# Altium project Power_circuit.PrjPcb
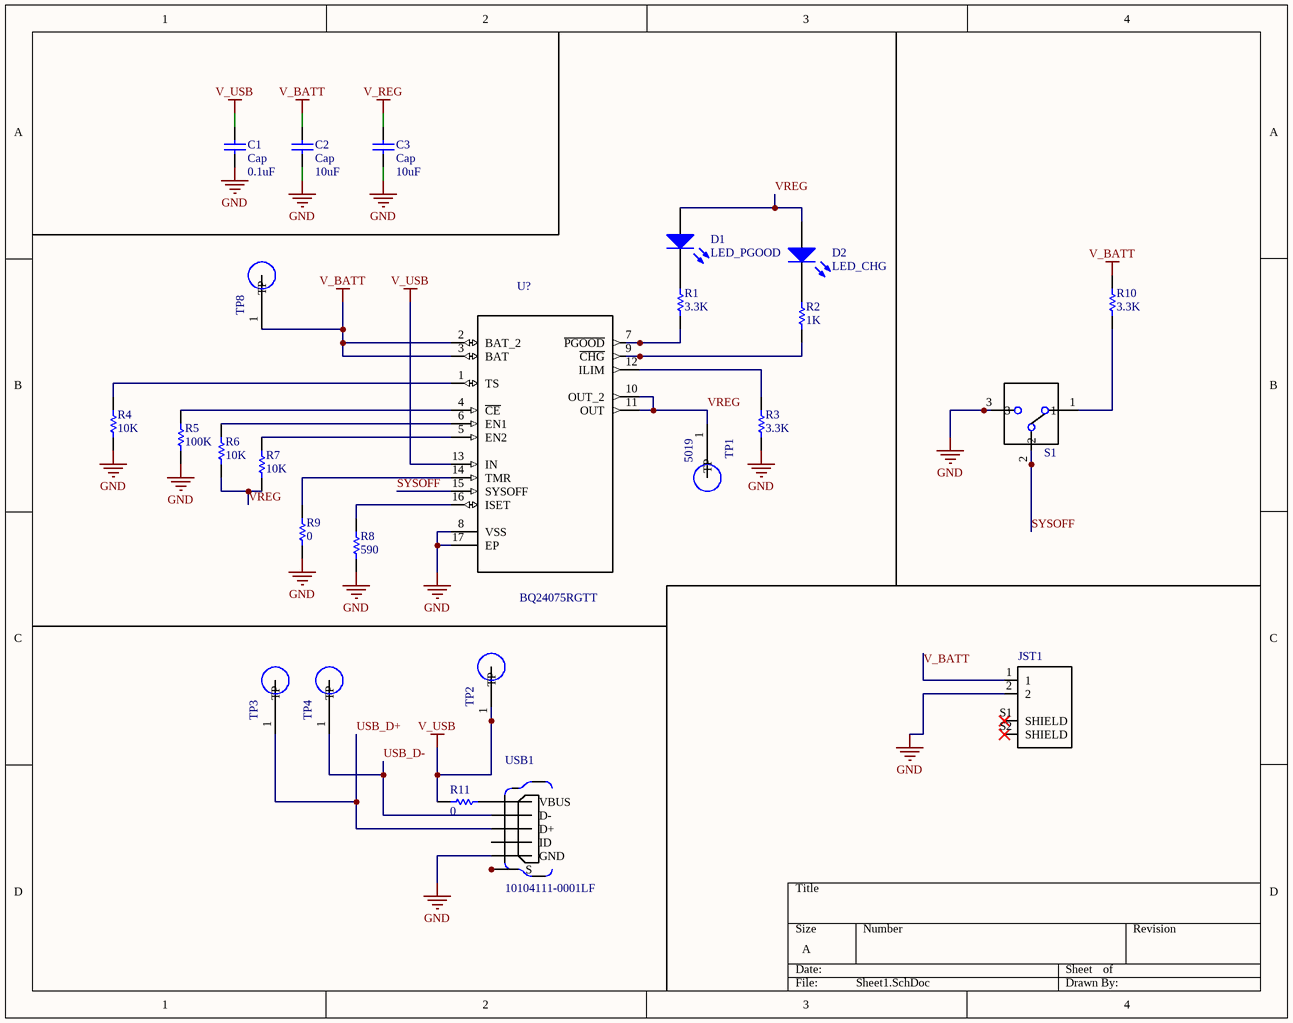
[diagram p0: Sheet1.SchDoc]
2 sheets, 35 parts. Net scope: global (net labels, ports and power ports of the same name join across sheets).
Sheets:
  Sheet1.SchDoc
  Sheet2.SchDoc

## Sheet Sheet1.SchDoc
size A

### Parts
C1  Cap  value 0.1uF  [1608[0603]]
C2  Cap  value 10uF  [1608[0603]]
C3  Cap  value 10uF  [1608[0603]]
D1  LED_PGOOD  [1608[0603]]
D2  LED_CHG  [1608[0603]]
JST1  S2B-PH-SM4-TB(LF)(SN)  [*JST_S2B-PH-SM4-TB(LF)(SN)_S2B-PH-SM4-TB(LF)(SN)(Primary)]  (value not drawn)
R1  value 3.3K  [1608[0603]]  (hidden comment: Res1)
R2  value 1K  [1608[0603]]  (hidden comment: Res1)
R3  value 3.3K  [1608[0603]]  (hidden comment: Res1)
R4  value 10K  [1608[0603]]  (hidden comment: Res1)
R5  value 100K  [1608[0603]]  (hidden comment: Res1)
R6  value 10K  [1608[0603]]  (hidden comment: Res1)
R7  value 10K  [1608[0603]]  (hidden comment: Res1)
R8  value 590  [1608[0603]]  (hidden comment: Res1)
R9  value 0  [1608[0603]]  (hidden comment: Res1)
R10  value 3.3K  [1608[0603]]  (hidden comment: Res1)
R11  value 0  [1608[0603]]  (hidden comment: Res1)
S1  CL-SB-12B-01T  [*CL-SB-12B]  (value not drawn)
TP1  5019  [*TP380X203]
TP2  5019  [*TP380X203]  (value not drawn)
TP3  5019  [*TP380X203]  (value not drawn)
TP4  5019  [*TP380X203]  (value not drawn)
TP8  5019  [*TP380X203]  (value not drawn)
U?  BQ24075RGTT  [*QFN50P300X300X100-17N]
USB1  10104111-0001LF  [*FRAMATOME_10104111-0001LF]

### Nets
GND: C1.1 C2.1 C3.1 JST1.2 R3.1 R4.1 R5.1 R8.1 R9.1 S1.3 U?.8(VSS) U?.17(EP) USB1.5(GND)
V_BATT: C2.2 JST1.1 R10.2 TP8.1(TP) U?.2(BAT_2) U?.3(BAT)
V_REG: C3.2
V_USB: C1.2 R11.2 TP2.1(TP) U?.13(IN)
VREG: D1.1(A) D2.1(A) R6.1 R7.1 TP1.1(TP) U?.10(OUT_2) U?.11(OUT)
SYSOFF: S1.2 U?.15(SYSOFF)
USB_D+: TP3.1(TP) USB1.3(D+)
USB_D-: TP4.1(TP) USB1.2(D-)
NetD1_2: D1.2(K) R1.2
NetD2_2: D2.2(K) R2.2
NetR1_1: R1.1 U?.7(~{PGOOD})
NetR2_1: R2.1 U?.9(~{CHG})
NetR3_2: R3.2 U?.12(ILIM)
NetR4_2: R4.2 U?.1(TS)
NetR5_2: R5.2 U?.4(~{CE})
NetR6_2: R6.2 U?.6(EN1)
NetR7_2: R7.2 U?.5(EN2)
NetR8_2: R8.2 U?.16(ISET)
NetR9_2: R9.2 U?.14(TMR)
NetR10_1: R10.1 S1.1
NetR11_1: R11.1 USB1.1(VBUS)
NetUSB1_6: USB1.6(S) USB1.7(S) USB1.8(S) USB1.9(S)

Not connected (* = marked no-connect by the designer): JST1 S1(SHIELD)* S2(SHIELD)*; USB1 4(ID)

### Library data of the parts
C1-C3 = Cap: 10000pF ±10% 50V Ceramic Capacitor X7R 0603 (1608 Metric); Manufacturer: Samsung Electro-Mechanics; Manufacturer Part Number: CL10B103KB8NNNC; Digi-Key Part Number: 1276-1009-1-ND; digi key link url: https://www.digikey.com/product-detail/en/samsung-electro-mechanics/CL10B103KB8NNNC/1276-1009-1-ND/3889095
D1 = LED2: LED GREEN DIFFUSED 0603 SMD; Manufacturer: OSRAM Opto Semiconductors Inc.; Manufacturer Part Number: LG L29K-F2J1-24-Z; Digi-Key Part Number: 475-3118-1-ND; ComponentLink1URL: https://www.digikey.com/product-detail/en/osram-opto-semiconductors-inc/LG-L29K-F2J1-24-Z/475-3118-1-ND/4899549; ComponentLink1Description: Digi-Key Link
D2 = LED2: Blue 470nm LED Indication - Discrete 2.85V 0603 (1608 Metric); Manufacturer: OSRAM Opto Semiconductors Inc.; Manufacturer Part Number: LB Q39G-L2OO-35-1; Digi-Key Part Number: 475-2816-1-ND; ComponentLink1URL: https://www.digikey.com/product-detail/en/osram-opto-semiconductors-inc/LB-Q39G-L2OO-35-1/475-2816-1-ND/2176355; ComponentLink1Description: Digi-Key Link
JST1 = S2B-PH-SM4-TB(LF)(SN): PH Series 2 Position 2 mm Pitch Surface Mount Side Entry Shrouded Header; MF: JST Sales; MP: S2B-PH-SM4-TB_LF__SN_; SnapEDA_Link: https://www.snapeda.com/parts/S2B-PH-SM4-TB%28LF%29%28SN%29/JST%20Sales%20America%20Inc./view-part/?ref=snap; Availability: Unavailable; Price: None; Package: None; Value: *
R1-R11 = Res1: 10 kOhms ±1% 0.125W, 1/8W Chip Resistor 0603 (1608 Metric) Anti-Sulfur, Moisture Resistant Thin Film; Manufacturer: Stackpole Electronics Inc; Manufacturer Part Number: RNCP0603FTD10K0; Digi-Key Part Number: RNCP0603FTD10K0CT-ND; digi key link url: https://www.digikey.com/product-detail/en/stackpole-electronics-inc/RNCP0603FTD10K0/RNCP0603FTD10K0CT-ND/2240478
S1 = CL-SB-12B-01T: SWITCH SLIDE SPDT 200MA 12V; MF: Nidec Copal; SnapEDA_Link: https://www.snapeda.com/parts/CL-SB-12B-01T/Nidec%20Copal%20Electronics/view-part/?ref=snap; Component_link_url: https://www.digikey.com/product-detail/en/nidec-copal-electronics/CL-SB-12B-01T/563-1318-1-ND/3507878; MP: CL-SB-12B-01T; Digi-Key Part Number: 563-1318-1-ND
TP1-TP4 TP8 = 5019: Phosphor Bronze Contact Miniature Silver Plated Surface Mount Test Points; MF: Keystone Electronics; Package: 2010 Keystone; Price: None; Availability: Unavailable; MP: 5019; SnapEDA_Link: https://www.snapeda.com/parts/5019/Keystone%20Electronics/view-part/?ref=snap; Value: *
U? = BQ24075RGTT: USB-Friendly Li-Ion Battery Charger and Power-Path Management IC, Vout 5.5V 16-QFN -40 to 85; Manufacturer Part Number: BQ24075RGTR; MF: Texas Instruments; SnapEDA_Link: https://www.snapeda.com/parts/BQ24075RGTT/Texas%20Instruments/view-part/?ref=snap; Price: None; MP: BQ24075RGTT; Package: QFN-16 Texas Instruments; Value: *; Digi-Key Part Number: 296-38874-1-ND
USB1 = 10104111-0001LF: Micro Usb, 2.0 Type Ab, Receptacle, Th; MF: Amphenol ICC; Package: None; Price: None; Component_link_url: https://www.digikey.com/product-detail/en/amphenol-fci/10104111-0001LF/609-4053-1-ND/2350359?utm_source=snapeda&utm_medium=aggregator&utm_campaign=symbol; MP: 10104111-0001LF; SnapEDA_Link: https://www.snapeda.com/parts/10104111-0001LF/Amphenol%20ICC/view-part/?ref=snap

## Sheet Sheet2.SchDoc
size A
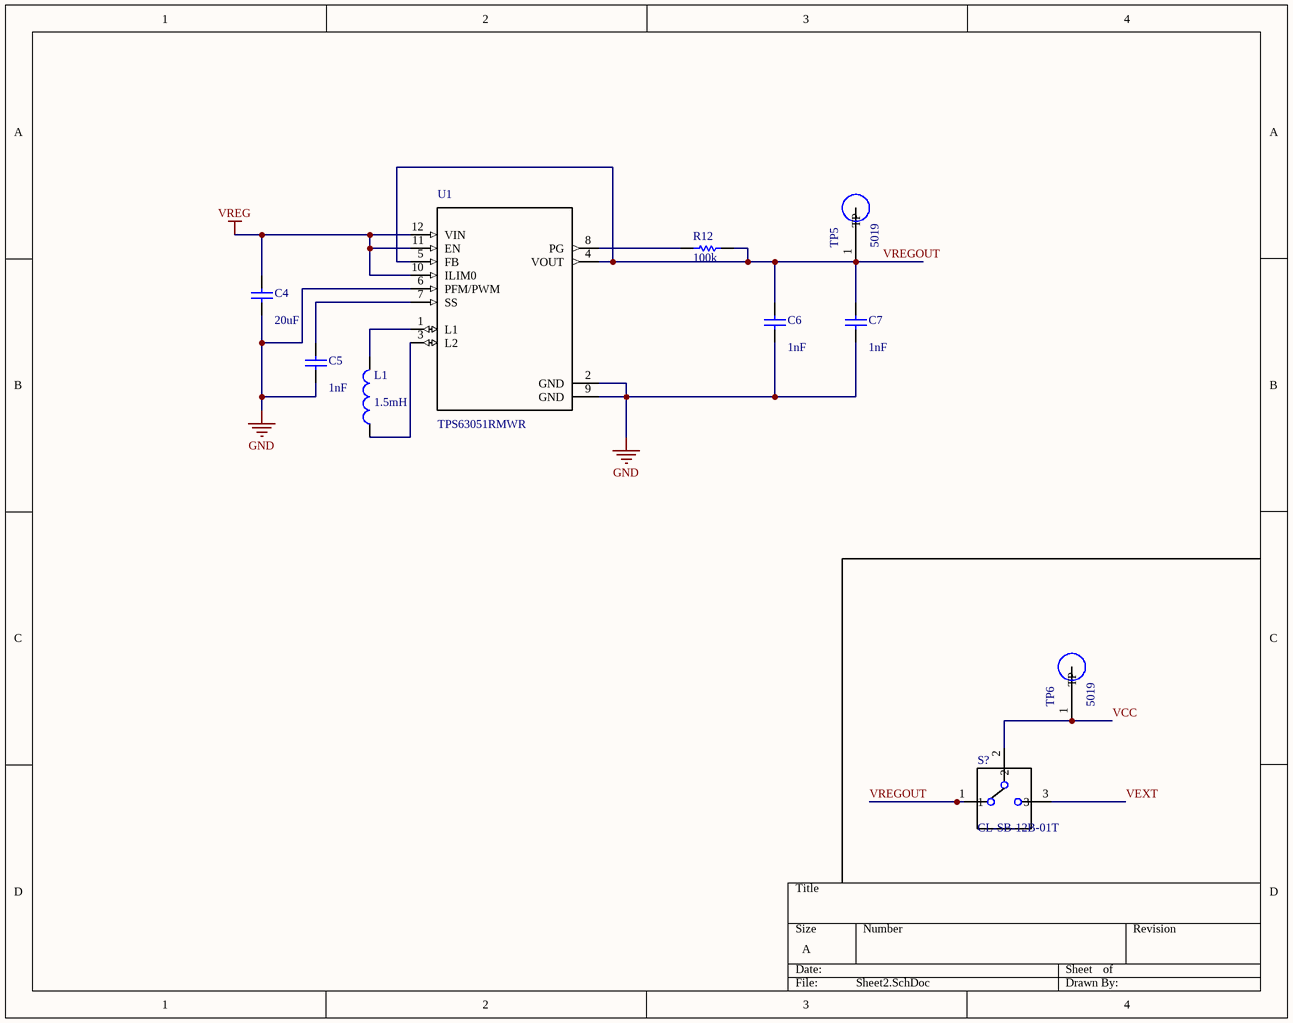
[diagram p1: Sheet2.SchDoc]

### Parts
C4  value 20uF  [1608[0603]]  (hidden comment: Cap)
C5  value 1nF  [1608[0603]]  (hidden comment: Cap)
C6  value 1nF  [1608[0603]]  (hidden comment: Cap)
C7  value 1nF  [1608[0603]]  (hidden comment: Cap)
L1  value 1.5mH  [0402-A]  (hidden comment: Inductor)
R12  value 100k  [1608[0603]]  (hidden comment: Res1)
S?  CL-SB-12B-01T  [*CL-SB-12B]
TP5  5019  [*TP380X203]
TP6  5019  [*TP380X203]
U1  TPS63051RMWR  [*QFN50P250X250X100-12N]

### Nets
GND: C4.1 C5.1 C6.1 C7.1 U1.2(GND) U1.6(PFM/PWM) U1.9(GND)
VREG: C4.2 U1.10(ILIM0) U1.11(EN) U1.12(VIN)
VCC: S?.2 TP6.1(TP)
VEXT: S?.3
VREGOUT: C6.2 C7.2 R12.1 S?.1 TP5.1(TP) U1.4(VOUT) U1.5(FB)
NetC5_2: C5.2 U1.7(SS)
NetL1_1: L1.1 U1.3(L2)
NetL1_2: L1.2 U1.1(L1)
NetR12_2: R12.2 U1.8(PG)

### Library data of the parts
C4-C7 = Cap: as C1 on sheet Sheet1; Digi-Key Part Number: 1276-1009-1-ND; digi key link url: https://www.digikey.com/product-detail/en/samsung-electro-mechanics/CL10B103KB8NNNC/1276-1009-1-ND/3889095
R12 = Res1: as R1 on sheet Sheet1; Digi-Key Part Number: RNCP0603FTD10K0CT-ND; digi key link url: https://www.digikey.com/product-detail/en/stackpole-electronics-inc/RNCP0603FTD10K0/RNCP0603FTD10K0CT-ND/2240478
S? = CL-SB-12B-01T: Switch Slide N.O./N.C. SPDT Top Slide 0.2A 12VDC Gull Wing SMD T/R; MF: Nidec Copal; SnapEDA_Link: https://www.snapeda.com/parts/CL-SB-12B-01T/Nidec%20Copal%20Electronics/view-part/?ref=snap; Availability: Unavailable; Price: None; MP: CL-SB-12B-01T; Package: None; Value: *
TP5 TP6 = 5019: as TP1 on sheet Sheet1; Package: 2010 Keystone; Price: None; Availability: Unavailable; MP: 5019; SnapEDA_Link: https://www.snapeda.com/parts/5019/Keystone%20Electronics/view-part/?ref=snap; Value: *
U1 = TPS63051RMWR: Tiny Single Inductor Buck Boost Converter 12-VQFN -40 to 85; MF: Texas Instruments; Package: VQFN-12 Texas Instruments; Price: None; Availability: Unavailable; MP: TPS63051RMWR; SnapEDA_Link: https://www.snapeda.com/parts/TPS63051RMWR/Texas%20Instruments/view-part/?ref=snap; Value: *

## Nets that join several sheets
GND: Sheet1 (13 pins), Sheet2 (7 pins)
VREG: Sheet1 (7 pins), Sheet2 (C4.2 U1.10 U1.11 U1.12)